# Altium schematic sheet FetController.SchDoc
size A4; DocumentNumber: 2; SheetNumber: 2; SheetTotal: 6
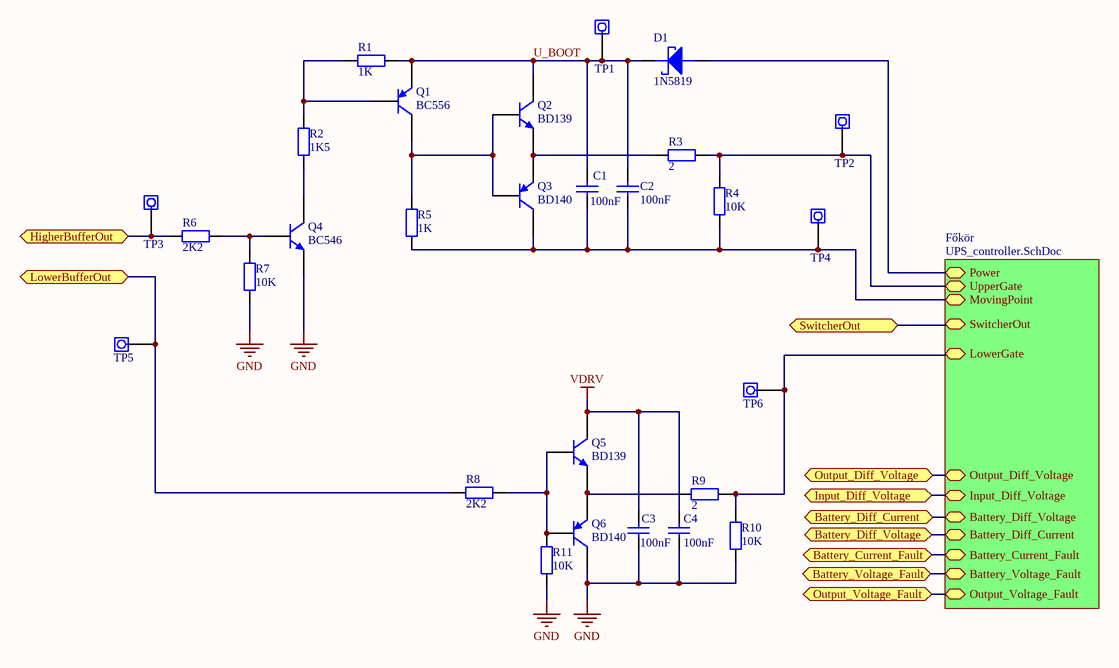
[diagram p0: FetController.SchDoc]

## Parts
C1  100nF  [FP_0805_CAP_085]
C2  100nF  [FP_0805_CAP_085]
C3  100nF  [FP_0805_CAP_085]
C4  100nF  [FP_0805_CAP_085]
D1  1N5819  [AXIAL-0.3]
Q1  BC556  [TO-92]
Q2  BD139  [TO-32]
Q3  BD140  [TO-32]
Q4  BC546  [TO-92]
Q5  BD139  [TO-32]
Q6  BD140  [TO-32]
R1  1K  [AXIAL-0.3]
R2  1K5  [AXIAL-0.3]
R3  2  [AXIAL-0.3]
R4  10K  [AXIAL-0.3]
R5  1K  [AXIAL-0.3]
R6  2K2  [AXIAL-0.3]
R7  10K  [AXIAL-0.3]
R8  2K2  [AXIAL-0.3]
R9  2  [AXIAL-0.3]
R10  10K  [AXIAL-0.3]
R11  10K  [AXIAL-0.3]
TP1  Testpoint  [TESTPOINT_1.5]  (value not drawn)  (no BOM)
TP2  Testpoint  [TESTPOINT_1.5]  (value not drawn)  (no BOM)
TP3  Testpoint  [TESTPOINT_1.5]  (value not drawn)  (no BOM)
TP4  Testpoint  [TESTPOINT_1.5]  (value not drawn)  (no BOM)
TP5  Testpoint  [TESTPOINT_1.5]  (value not drawn)  (no BOM)
TP6  Testpoint  [TESTPOINT_1.5]  (value not drawn)  (no BOM)

## Sub-sheets
Főkör = UPS_controller.SchDoc: Power, MovingPoint, UpperGate, LowerGate, SwitcherOut, Output_Diff_Voltage, Input_Diff_Voltage, Battery_Diff_Voltage, Battery_Diff_Current, Battery_Current_Fault, Battery_Voltage_Fault, Output_Voltage_Fault

## Ports
Battery_Current_Fault, Battery_Diff_Current, Battery_Diff_Voltage, Battery_Voltage_Fault, HigherBufferOut, Input_Diff_Voltage, LowerBufferOut, Output_Diff_Voltage, Output_Voltage_Fault, SwitcherOut

## Nets
GND: C3.1 C4.1 Q4.3(E) Q6.2(C) R7.1 R10.1 R11.1
VDRV: C3.2 C4.2 Q5.2(C)
Battery_Current_Fault: port Battery_Current_Fault, sheet Főkör/Battery_Current_Fault
Battery_Diff_Current: port Battery_Diff_Current, sheet Főkör/Battery_Diff_Voltage
Battery_Diff_Voltage: port Battery_Diff_Voltage, sheet Főkör/Battery_Diff_Current
Battery_Voltage_Fault: port Battery_Voltage_Fault, sheet Főkör/Battery_Voltage_Fault
HigherBufferOut: R6.2 TP3.1 ; port HigherBufferOut
Input_Diff_Voltage: port Input_Diff_Voltage, sheet Főkör/Input_Diff_Voltage
LowerBufferOut: R8.2 TP5.1 ; port LowerBufferOut
Output_Diff_Voltage: port Output_Diff_Voltage, sheet Főkör/Output_Diff_Voltage
Output_Voltage_Fault: port Output_Voltage_Fault, sheet Főkör/Output_Voltage_Fault
SwitcherOut: port SwitcherOut, sheet Főkör/SwitcherOut
U_BOOT: C1.2 C2.2 D1.1(CATHODE) Q1.3(E) Q2.2(C) R1.1 TP1.1
NetC1_1: C1.1 C2.1 Q3.2(C) R4.1 R5.1 TP4.1 ; sheet Főkör/MovingPoint
NetD1_2: D1.2(ANODE) ; sheet Főkör/Power
NetQ1_1: Q1.1(C) Q2.3(B) Q3.1(B) R5.2
NetQ1_2: Q1.2(B) R1.2 R2.2
NetQ2_1: Q2.1(E) Q3.3(E) R3.1
NetQ4_1: Q4.1(C) R2.1
NetQ4_2: Q4.2(B) R6.1 R7.2
NetQ5_1: Q5.1(E) Q6.3(E) R9.1
NetQ5_3: Q5.3(B) Q6.1(B) R8.1 R11.2
NetR3_2: R3.2 R4.2 TP2.1 ; sheet Főkör/UpperGate
NetR9_2: R9.2 R10.2 TP6.1 ; sheet Főkör/LowerGate

## Library data of the parts
C1-C4 = CAP: Capacitor; Value: 100nF; Lomex NR: 82-07-32
D1 = SCHOTTKY: NXP - PMEG3020EJ,115 - SCHOTTKY RECT 30V 2A SOD323F; Supplier: 16-04-12; Type: 1N5819
Q1 = BC556: PNP tranzisztor; Lomex NR: 21-06-74
Q2 Q5 = BD139: NPN tranzisztor; Lomex NR: 21-11-08
Q3 Q6 = BD140: PNP tranzisztor; Lomex NR: 21-11-09
Q4 = BC546: NPN tranzisztor; Lomex NR: 21-11-18
R1-R11 = RES: Resistor
  R1 R5: Value: 1K
  R2: Value: 1K5
  R3 R9: Value: 2
  R4 R7 R10 R11: Value: 10K
  R6 R8: Value: 2K2
TP1-TP6 = Testpoint: Part Class: Connector